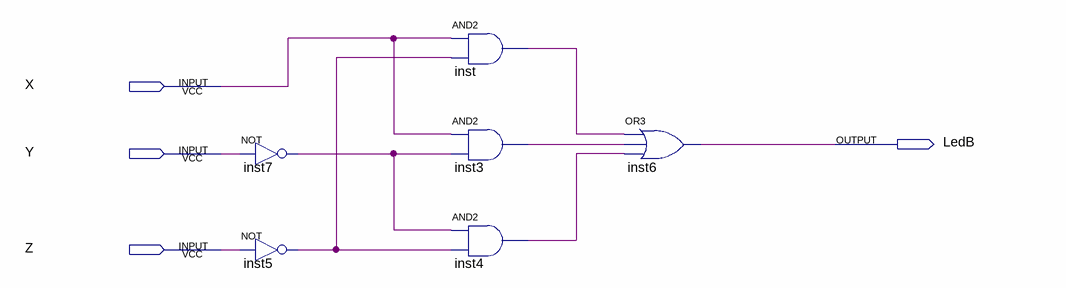
[diagram p0: schematic sheet]
// Quartus schematic LEDb.bdf as structural Verilog: 6 symbols, 4 pins
module LEDb (
  input  X,
  input  Y,
  input  Z,
  output LedB
);

  wire inst3_out, inst4_out, inst5_out, inst7_out, inst_out;

  not inst7 (inst7_out, Y);
  not inst5 (inst5_out, Z);
  and inst (inst_out, X, inst5_out);
  and inst3 (inst3_out, X, inst7_out);
  and inst4 (inst4_out, inst7_out, inst5_out);
  or inst6 (LedB, inst_out, inst3_out, inst4_out);
endmodule
